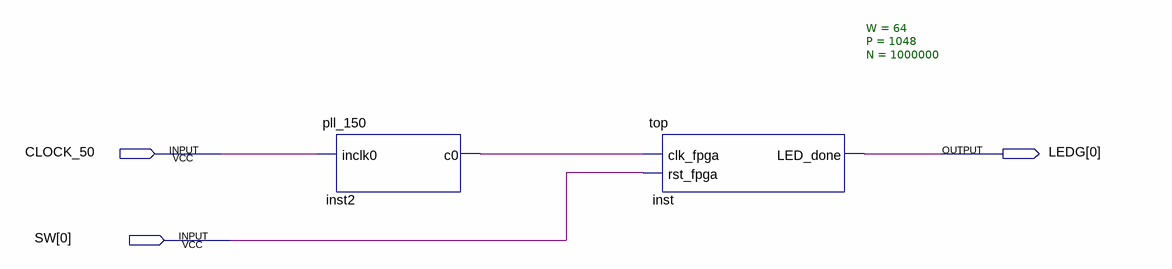
[diagram p0: schematic sheet]
// Quartus schematic top.bdf as structural Verilog: 2 symbols, 3 pins
module top (
  input  CLOCK_50,
  input  [0:0] SW,
  output [0:0] LEDG
);

  wire inst2_c0;

  pll_150 inst2 (.inclk0(CLOCK_50), .c0(inst2_c0));
  top #(.W(64), .P(1048), .N(1000000)) inst (.clk_fpga(inst2_c0), .rst_fpga(SW[0]), .LED_done(LEDG[0]));
endmodule
